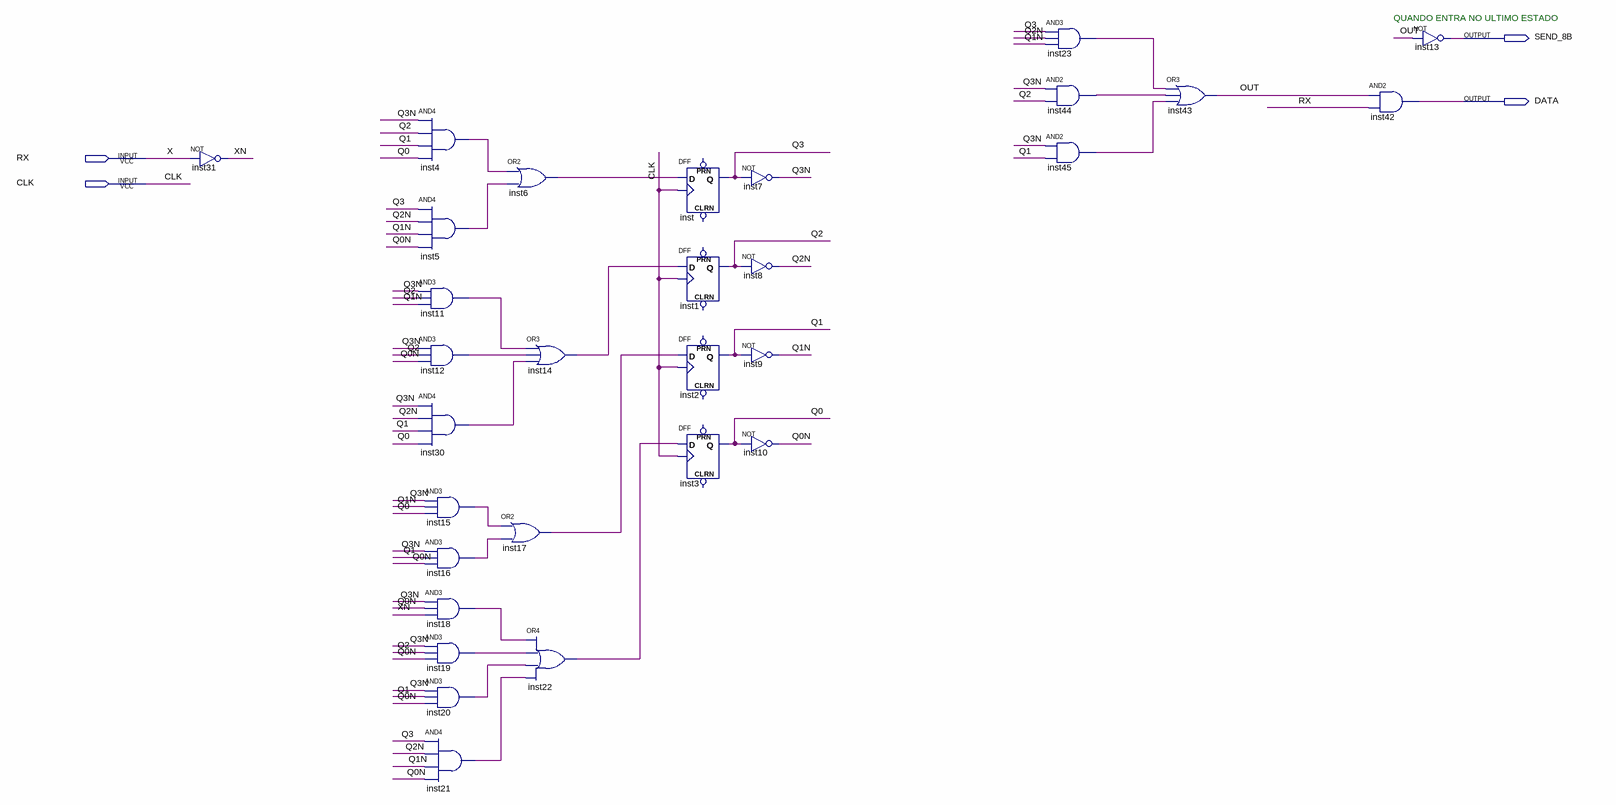
[diagram p0: schematic sheet]
// Quartus schematic MEF.bdf as structural Verilog: 30 symbols, 4 pins
module MEF (
  input  RX,
  input  CLK,
  output SEND_8B,
  output DATA
);

  wire inst4_out, inst5_out, inst6_out, inst11_out, inst12_out, inst14_out, inst15_out, inst16_out,
       inst17_out, inst18_out, inst19_out, inst20_out, inst21_out, inst22_out, inst23_out, inst30_out,
       inst44_out, inst45_out, OUT, Q0, Q0N, Q1, Q1N, Q2, Q2N, Q3, Q3N, XN;

  not inst31 (XN, RX);
  and inst4 (inst4_out, Q3N, Q2, Q1, Q0);
  and inst5 (inst5_out, Q3, Q2N, Q1N, Q0N);
  and inst11 (inst11_out, Q3N, Q2, Q1N);
  and inst12 (inst12_out, Q3N, Q2, Q0N);
  and inst30 (inst30_out, Q3N, Q2N, Q1, Q0);
  and inst15 (inst15_out, Q3N, Q1N, Q0);
  and inst16 (inst16_out, Q3N, Q1, Q0N);
  and inst18 (inst18_out, Q3N, Q0N, XN);
  and inst19 (inst19_out, Q3N, Q2, Q0N);
  and inst20 (inst20_out, Q3N, Q1, Q0N);
  and inst21 (inst21_out, Q3, Q2N, Q1N, Q0N);
  or inst6 (inst6_out, inst4_out, inst5_out);
  or inst14 (inst14_out, inst11_out, inst12_out, inst30_out);
  or inst17 (inst17_out, inst15_out, inst16_out);
  or inst22 (inst22_out, inst18_out, inst19_out, inst20_out, inst21_out);
  DFF inst (.CLK(CLK), .D(inst6_out), .Q(Q3));  // open: CLRN, PRN
  DFF inst1 (.CLK(CLK), .D(inst14_out), .Q(Q2));  // open: CLRN, PRN
  DFF inst2 (.CLK(CLK), .D(inst17_out), .Q(Q1));  // open: CLRN, PRN
  DFF inst3 (.CLK(CLK), .D(inst22_out), .Q(Q0));  // open: CLRN, PRN
  not inst7 (Q3N, Q3);
  not inst8 (Q2N, Q2);
  not inst9 (Q1N, Q1);
  not inst10 (Q0N, Q0);
  and inst23 (inst23_out, Q3, Q2N, Q1N);
  and inst44 (inst44_out, Q3N, Q2);
  and inst45 (inst45_out, Q3N, Q1);
  or inst43 (OUT, inst23_out, inst44_out, inst45_out);
  and inst42 (DATA, OUT, RX);
  not inst13 (SEND_8B, OUT);

  // Other names for the same wires on the sheet: X = RX

  // Notes on the sheet:
  //   QUANDO ENTRA NO ULTIMO ESTADO
endmodule
